# Altium project PicoBOB_DLX.PrjPCB
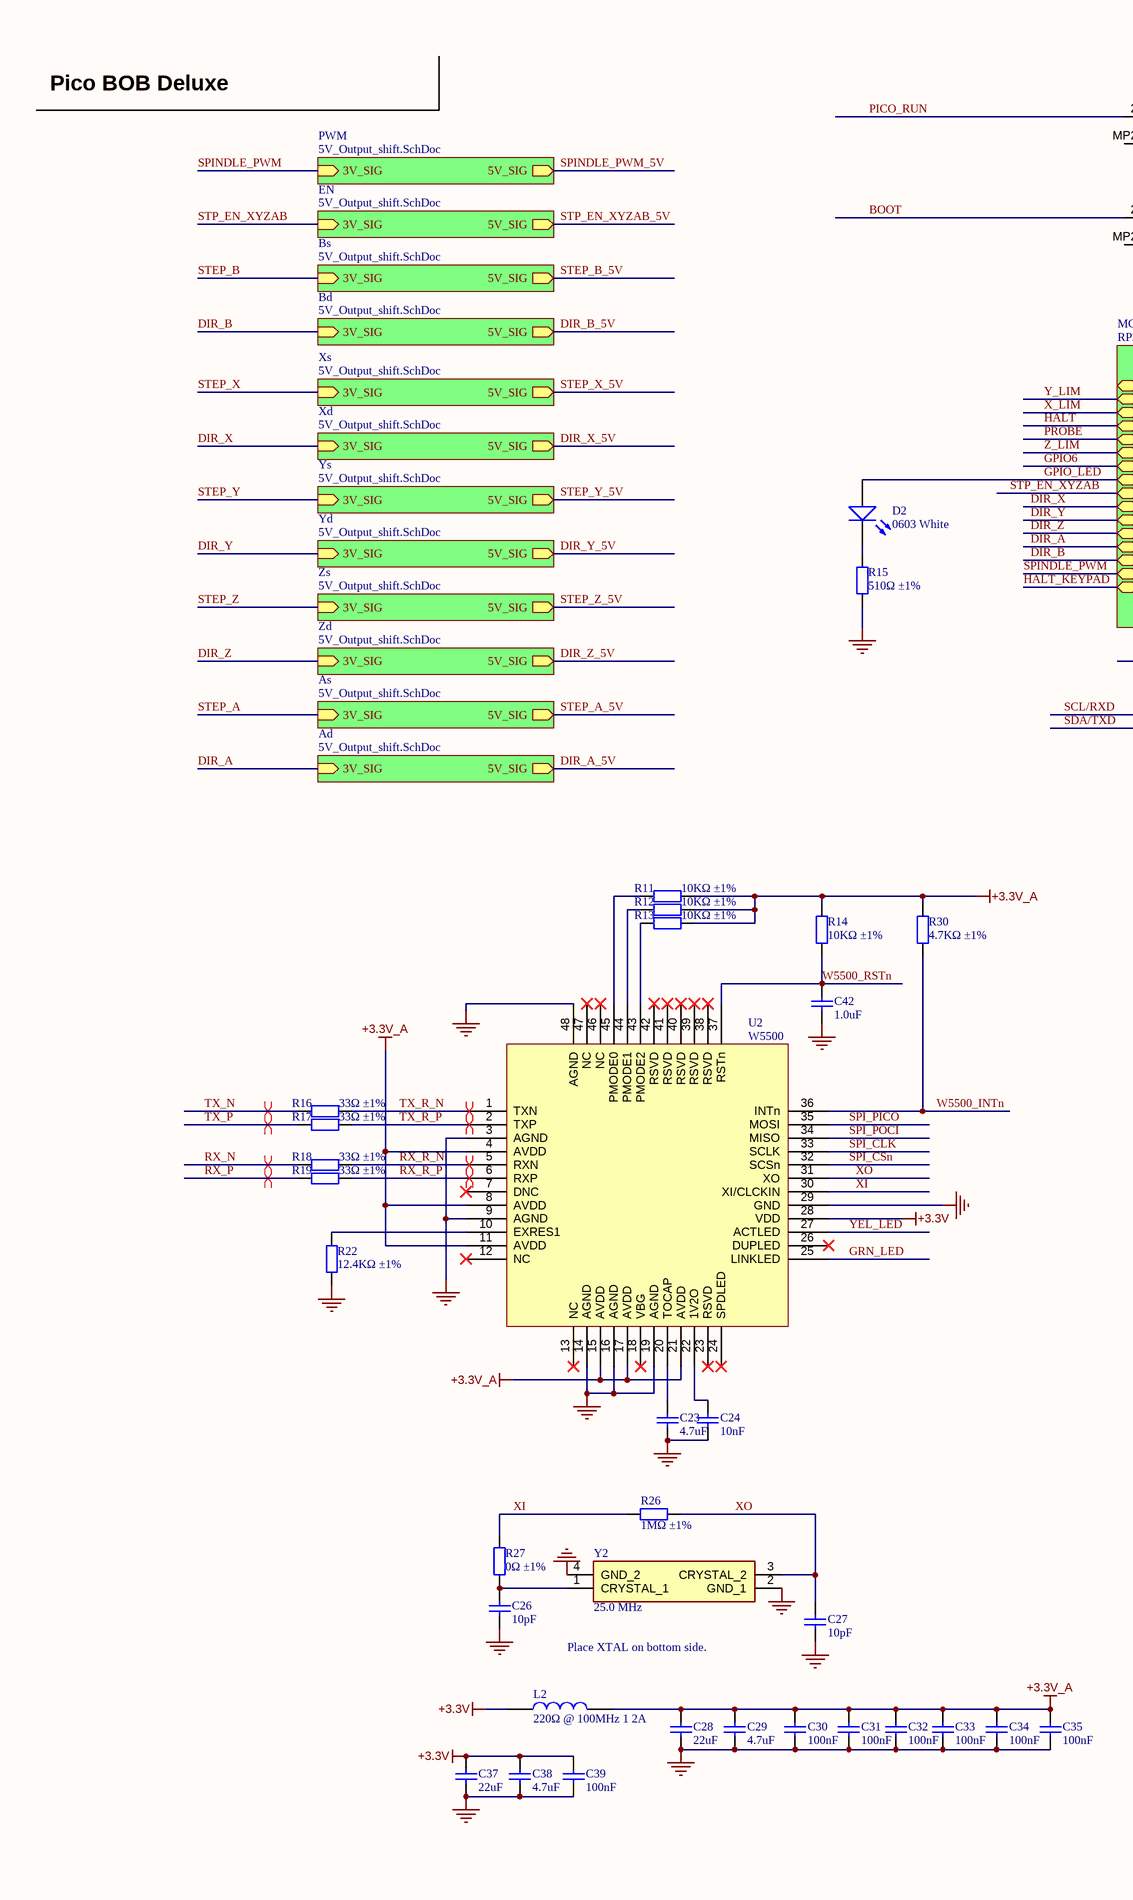
[diagram p0: PicoBOB_DLX.SchDoc, left]
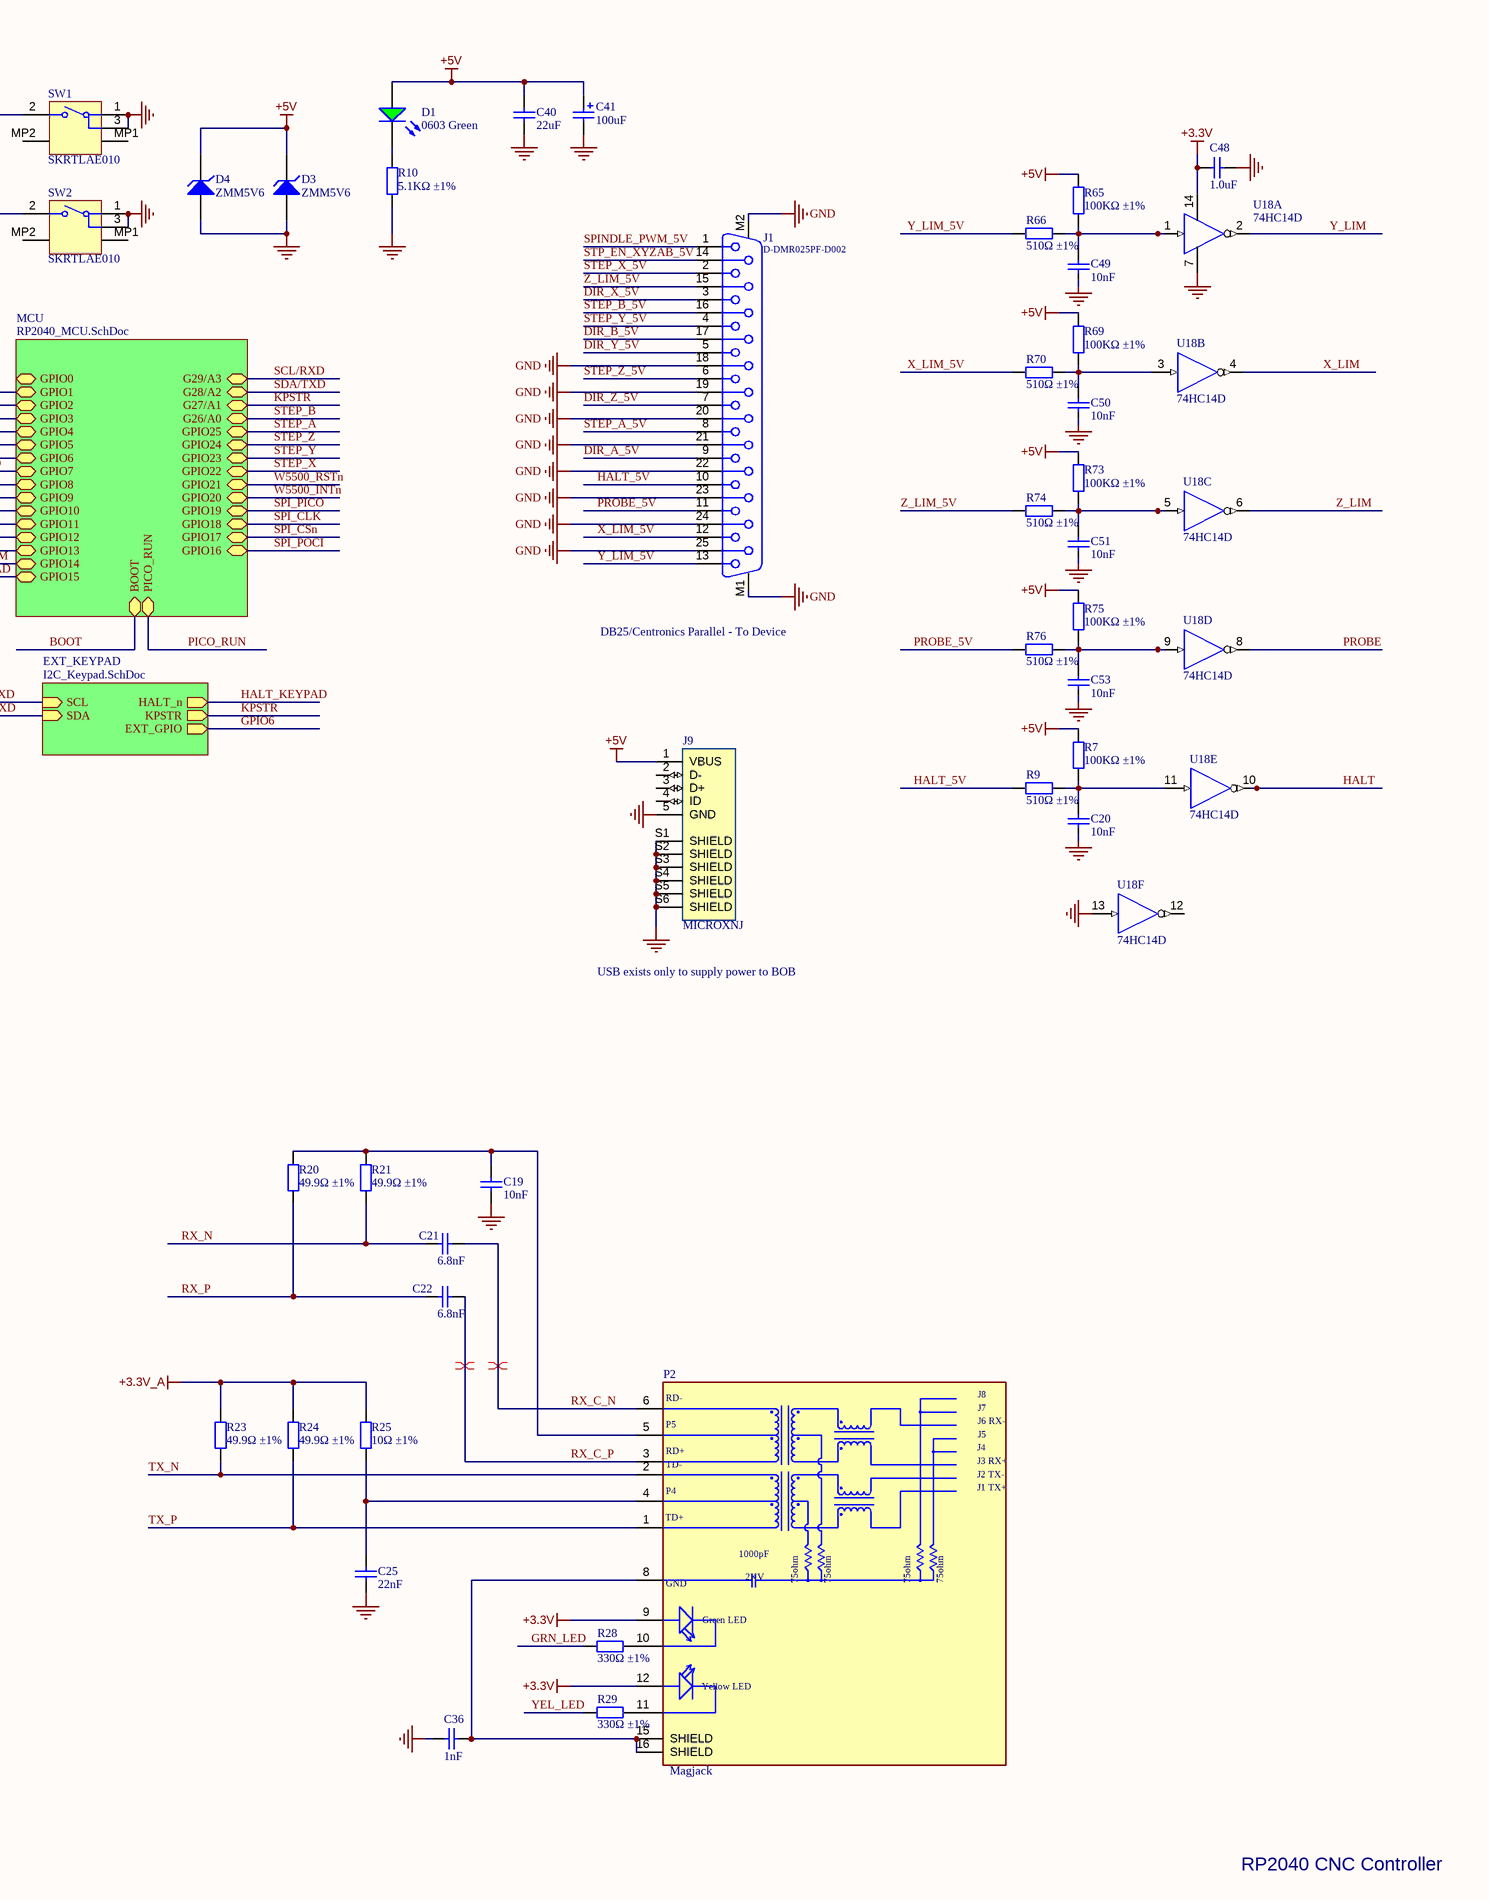
[diagram p1: PicoBOB_DLX.SchDoc, right]
PCBPARTNO: PicoBOB_DLX; PCBREVNO: A3; Title: PicoBOB_DLX; VarRevNo: A3
4 sheets, 143 parts. Net scope: hierarchical (ports join the sheet entries above them; power ports are global).
Board file: PicoBOB_DLX.pcbdoc
Sheets:
  PicoBOB_DLX.SchDoc
    PWM = 5V_Output_shift.SchDoc
    EN = 5V_Output_shift.SchDoc
    Xs = 5V_Output_shift.SchDoc
    Xd = 5V_Output_shift.SchDoc
    Ys = 5V_Output_shift.SchDoc
    Yd = 5V_Output_shift.SchDoc
    Zs = 5V_Output_shift.SchDoc
    Zd = 5V_Output_shift.SchDoc
    As = 5V_Output_shift.SchDoc
    Ad = 5V_Output_shift.SchDoc
    Bs = 5V_Output_shift.SchDoc
    Bd = 5V_Output_shift.SchDoc
    MCU = RP2040_MCU.SchDoc
    EXT_KEYPAD = I2C_Keypad.SchDoc

## Sheet PicoBOB_DLX.SchDoc: RP2040 CNC
size C; Author: AM; CompanyName: Expatria Technologies; DrawnBy: A.Marles; Engineer: AM; Organization: Expatria Technolgoies; Address1: Schematic; DocumentNumber: 2; Revision: A3; SheetNumber: 2; SheetTotal: 4

### Parts
C19  10nF  [0402_C]
C20  10nF  [0402_C]
C21  6.8nF  [0402_C]
C22  6.8nF  [0402_C]
C23  4.7uF  [0402_C]
C24  10nF  [0402_C]
C25  22nF  [0402_C]
C26  10pF  [0402_C]
C27  10pF  [0402_C]
C28  22uF  [0805_C]
C29  4.7uF  [0603_C]
C30  100nF  [0402_C]
C31  100nF  [0402_C]
C32  100nF  [0402_C]
C33  100nF  [0402_C]
C34  100nF  [0402_C]
C35  100nF  [0402_C]
C36  1nF  [1206_C]
C37  22uF  [0805_C]
C38  4.7uF  [0603_C]
C39  100nF  [0402_C]
C40  22uF  [0805_C]
C41  100uF  [CASE-B_3528]
C42  1.0uF  [0402_C]
C48  1.0uF  [0402_C]
C49  10nF  [0402_C]
C50  10nF  [0402_C]
C51  10nF  [0402_C]
C53  10nF  [0402_C]
D1  0603 Green  [0603_LED_S1]
D2  0603 White  [0603_LED_S1]
D3  ZMM5V6  [LL-34]
D4  ZMM5V6  [LL-34]
J1  D-DMR025PF-D002  [618025231121]
J9  MICROXNJ  [SHOUHAN_MICROXNJ]
L2  220Ω @ 100MHz 1 2A  [0805_C]
P2  Magjack  [HANRUN_HR911105A]
R7  100KΩ ±1%  [0402_R]
R9  510Ω ±1%  [0402_R]
R10  5.1KΩ ±1%  [0402_R]
R11  10KΩ ±1%  [0402_R]
R12  10KΩ ±1%  [0402_R]
R13  10KΩ ±1%  [0402_R]
R14  10KΩ ±1%  [0402_R]
R15  510Ω ±1%  [0402_R]
R16  33Ω ±1%  [0402_R]
R17  33Ω ±1%  [0402_R]
R18  33Ω ±1%  [0402_R]
R19  33Ω ±1%  [0402_R]
R20  49.9Ω ±1%  [0402_R]
R21  49.9Ω ±1%  [0402_R]
R22  12.4KΩ ±1%  [0603_R]
R23  49.9Ω ±1%  [0402_R]
R24  49.9Ω ±1%  [0402_R]
R25  10Ω ±1%  [0402_R]
R26  1MΩ ±1%  [0402_R]
R27  0Ω ±1%  [0402_R]
R28  330Ω ±1%  [0402_R]
R29  330Ω ±1%  [0402_R]
R30  4.7KΩ ±1%  [0402_R]
R65  100KΩ ±1%  [0402_R]
R66  510Ω ±1%  [0402_R]
R69  100KΩ ±1%  [0402_R]
R70  510Ω ±1%  [0402_R]
R73  100KΩ ±1%  [0402_R]
R74  510Ω ±1%  [0402_R]
R75  100KΩ ±1%  [0402_R]
R76  510Ω ±1%  [0402_R]
SW1  SKRTLAE010  [ALPS-SKRTLAE010_V]
SW2  SKRTLAE010  [ALPS-SKRTLAE010_V]
U2  W5500  [LQFP-48_7x7x05P]
U18  74HC14D  [SOIC-14_150mil]  (parts A,B,C,D,E,F of 6)
Y2  25.0 MHz  [YSX321SL]

### Sub-sheets
Ad = 5V_Output_shift.SchDoc: 3V_SIG (in), 5V_SIG (out)
As = 5V_Output_shift.SchDoc: 3V_SIG (in), 5V_SIG (out)
Bd = 5V_Output_shift.SchDoc: 3V_SIG (in), 5V_SIG (out)
Bs = 5V_Output_shift.SchDoc: 3V_SIG (in), 5V_SIG (out)
EN = 5V_Output_shift.SchDoc: 3V_SIG (in), 5V_SIG (out)
EXT_KEYPAD = I2C_Keypad.SchDoc: HALT_n (out), SCL (in), KPSTR (out), SDA (in), EXT_GPIO (out)
MCU = RP2040_MCU.SchDoc: G28/A2 (bidir), GPIO20 (bidir), GPIO14 (bidir), GPIO25 (bidir), GPIO15 (bidir), GPIO8 (bidir), GPIO1 (bidir), G27/A1 (bidir), GPIO0 (bidir), GPIO13 (bidir), G26/A0 (bidir), GPIO21 (bidir), PICO_RUN (bidir), G29/A3 (bidir), GPIO7 (bidir), GPIO6 (bidir), GPIO12 (bidir), GPIO2 (bidir), GPIO4 (bidir), GPIO17 (bidir), GPIO10 (bidir), GPIO11 (bidir), GPIO23 (bidir), GPIO22 (bidir), GPIO18 (bidir), GPIO5 (bidir), GPIO9 (bidir), GPIO3 (bidir), GPIO24 (bidir), GPIO19 (bidir), GPIO16 (bidir), BOOT (bidir)
PWM = 5V_Output_shift.SchDoc: 3V_SIG (in), 5V_SIG (out)
Xd = 5V_Output_shift.SchDoc: 3V_SIG (in), 5V_SIG (out)
Xs = 5V_Output_shift.SchDoc: 3V_SIG (in), 5V_SIG (out)
Yd = 5V_Output_shift.SchDoc: 3V_SIG (in), 5V_SIG (out)
Ys = 5V_Output_shift.SchDoc: 3V_SIG (in), 5V_SIG (out)
Zd = 5V_Output_shift.SchDoc: 3V_SIG (in), 5V_SIG (out)
Zs = 5V_Output_shift.SchDoc: 3V_SIG (in), 5V_SIG (out)

### Nets
+3.3V: C37.2 C38.2 C39.2 C48.1 L2.1 P2.9(GA) P2.12(YA) U2.28(VDD) U18.14(VDD)
+3.3V_A: C28.2 C29.2 C30.2 C31.2 C32.2 C33.2 C34.2 C35.2 L2.2 R11.1 R12.1 R13.1 R14.2 R23.1 R24.1 R25.1 R30.2 U2.4(AVDD) U2.8(AVDD) U2.11(AVDD) U2.15(AVDD) U2.17(AVDD) U2.21(AVDD)
+5V: C40.2 C41.1 D1.A D3.2(K) D4.2(K) J9.1(VBUS) R7.2 R65.2 R69.2 R73.2 R75.2
GND: C19.1 C20.1 C23.1 C24.1 C25.1 C26.1 C27.1 C28.1 C29.1 C30.1 C31.1 C32.1 C33.1 C34.1 C35.1 C36.1 C37.1 C38.1 C39.1 C40.1 C41.2 C42.1 C48.2 C49.1 C50.1 C51.1 C53.1 D3.1(A) D4.1(A) J1.18 J1.19 J1.20 J1.21 J1.22 J1.23 J1.24 J1.25 J1.M1 J1.M2 J9.5(GND) J9.S1(SHIELD) J9.S2(SHIELD) J9.S3(SHIELD) J9.S4(SHIELD) J9.S5(SHIELD) J9.S6(SHIELD) R10.2 R15.1 R22.1 SW1.1 SW1.3 SW2.1 SW2.3 U2.3(AGND) U2.9(AGND) U2.14(AGND) U2.16(AGND) U2.19(AGND) U2.29(GND) U2.48(AGND) U18.7(GND) U18.13(A) Y2.2(GND_1) Y2.4(GND_2)
BOOT: SW2.2 ; sheet MCU/BOOT
DIR_A: sheet Ad/3V_SIG, sheet MCU/GPIO12
DIR_A_5V: J1.9 ; sheet Ad/5V_SIG
DIR_B: sheet Bd/3V_SIG, sheet MCU/GPIO13
DIR_B_5V: J1.17 ; sheet Bd/5V_SIG
DIR_X: sheet Xd/3V_SIG, sheet MCU/GPIO9
DIR_X_5V: J1.3 ; sheet Xd/5V_SIG
DIR_Y: sheet Yd/3V_SIG, sheet MCU/GPIO10
DIR_Y_5V: J1.5 ; sheet Yd/5V_SIG
DIR_Z: sheet Zd/3V_SIG, sheet MCU/GPIO11
DIR_Z_5V: J1.7 ; sheet Zd/5V_SIG
GPIO6: sheet MCU/GPIO6, sheet EXT_KEYPAD/EXT_GPIO
GPIO_LED: D2.A ; sheet MCU/GPIO7
GRN_LED: R28.1 U2.25(LINKLED)
HALT: U18.10(Y) ; sheet MCU/GPIO3
HALT_5V: J1.10 R9.1
HALT_KEYPAD: sheet MCU/GPIO15, sheet EXT_KEYPAD/HALT_n
KPSTR: sheet MCU/G27/A1, sheet EXT_KEYPAD/KPSTR
PICO_RUN: SW1.2 ; sheet MCU/PICO_RUN
PROBE: U18.8(Y) ; sheet MCU/GPIO4
PROBE_5V: J1.11 R76.1
RX_C_N: C21.1 P2.6(RD-)
RX_C_P: C22.1 P2.3(RD+)
RX_N: C21.2 R18.1 R21.2
RX_P: C22.2 R19.1 R20.2
RX_R_N: R18.2 U2.5(RXN)
RX_R_P: R19.2 U2.6(RXP)
SCL/RXD: sheet MCU/G29/A3, sheet EXT_KEYPAD/SCL
SDA/TXD: sheet MCU/G28/A2, sheet EXT_KEYPAD/SDA
SPI_CLK: U2.33(SCLK) ; sheet MCU/GPIO18
SPI_CSn: U2.32(SCSn) ; sheet MCU/GPIO17
SPI_PICO: U2.35(MOSI) ; sheet MCU/GPIO19
SPI_POCI: U2.34(MISO) ; sheet MCU/GPIO16
SPINDLE_PWM: sheet PWM/3V_SIG, sheet MCU/GPIO14
SPINDLE_PWM_5V: J1.1 ; sheet PWM/5V_SIG
STEP_A: sheet As/3V_SIG, sheet MCU/GPIO25
STEP_A_5V: J1.8 ; sheet As/5V_SIG
STEP_B: sheet Bs/3V_SIG, sheet MCU/G26/A0
STEP_B_5V: J1.16 ; sheet Bs/5V_SIG
STEP_X: sheet Xs/3V_SIG, sheet MCU/GPIO22
STEP_X_5V: J1.2 ; sheet Xs/5V_SIG
STEP_Y: sheet Ys/3V_SIG, sheet MCU/GPIO23
STEP_Y_5V: J1.4 ; sheet Ys/5V_SIG
STEP_Z: sheet Zs/3V_SIG, sheet MCU/GPIO24
STEP_Z_5V: J1.6 ; sheet Zs/5V_SIG
STP_EN_XYZAB: sheet EN/3V_SIG, sheet MCU/GPIO8
STP_EN_XYZAB_5V: J1.14 ; sheet EN/5V_SIG
TX_N: P2.2(TD-) R16.1 R23.2
TX_P: P2.1(TD+) R17.1 R24.2
TX_R_N: R16.2 U2.1(TXN)
TX_R_P: R17.2 U2.2(TXP)
W5500_INTn: R30.1 U2.36(INTn) ; sheet MCU/GPIO20
W5500_RSTn: C42.2 R14.1 U2.37(RSTn) ; sheet MCU/GPIO21
X_LIM: U18.4(Y) ; sheet MCU/GPIO2
X_LIM_5V: J1.12 R70.1
XI: R26.1 R27.1 U2.30(XI/CLCKIN)
XO: C27.2 R26.2 U2.31(XO) Y2.3(CRYSTAL_2)
Y_LIM: U18.2(Y) ; sheet MCU/GPIO1
Y_LIM_5V: J1.13 R66.1
YEL_LED: R29.1 U2.27(ACTLED)
Z_LIM: U18.6(Y) ; sheet MCU/GPIO5
Z_LIM_5V: J1.15 R74.1
NetC19_2: C19.2 P2.5(P5) R20.1 R21.1
NetC20_2: C20.2 R7.1 R9.2 U18.11(A)
NetC23_2: C23.2 U2.20(TOCAP)
NetC24_2: C24.2 U2.22(1V2O)
NetC25_2: C25.2 P2.4(P4) R25.2
NetC26_2: C26.2 R27.2 Y2.1(CRYSTAL_1)
NetC36_2: C36.2 P2.8(GND) P2.15(SHIELD) P2.16(SHIELD)
NetC49_2: C49.2 R65.1 R66.2 U18.1(A)
NetC50_2: C50.2 R69.1 R70.2 U18.3(A)
NetC51_2: C51.2 R73.1 R74.2 U18.5(A)
NetC53_2: C53.2 R75.1 R76.2 U18.9(A)
NetD1_K: D1.K R10.1
NetD2_K: D2.K R15.2
NetP2_10: P2.10(GC) R28.2
NetP2_11: P2.11(YC) R29.2
NetR11_2: R11.2 U2.45(PMODE0)
NetR12_2: R12.2 U2.44(PMODE1)
NetR13_2: R13.2 U2.43(PMODE2)
NetR22_2: R22.2 U2.10(EXRES1)

Not connected (* = marked no-connect by the designer): J9 2(D-) 3(D+) 4(ID); SW1 MP1 MP2; SW2 MP1 MP2; U2 7(DNC)* 12(NC)* 13(NC)* 18(VBG)* 23(RSVD)* 24(SPDLED)* 26(DUPLED)* 38(RSVD)* 39(RSVD)* 40(RSVD)* 41(RSVD)* 42(RSVD)* 46(NC)* 47(NC)*; U18 12(Y)

### Layout directives
differential pair: RX_C_N, RX_C_P, RX_N, RX_P, RX_R_N, RX_R_P, TX_N, TX_P, TX_R_N, TX_R_P

### Notes on the sheet
- Pico BOB Deluxe
- DB25/Centronics Parallel - To Device
- USB exists only to supply power to BOB
- Place XTAL on bottom side.
- RP2040 CNC Controller
- Expatria Technologies
- SHEET
- PROJECT
- REV
- 1136 Glade Court
- Port Coquitlam, BC V3B 1R5
- EMAIL: INFO@EXPATRIA.CA
- SIZE
- ENGR
- C
- MODIFIED
- DOCUMENT
- /
- Copyright Expatria Technologies 2023. This document describes Open Hardware and is licensed under the CERN-OHL-S v2. No warranty is implied or expressed.
- (in symbol HR911105A) J8; J7; J6 RX-; J5; J4; J3 RX+; J2 TX-; J1 TX+; 1000pF; 2KV; 75ohm; Green LED; Yellow LED

### Library data of the parts
C19 C20 C24 C49-C51 C53 = 0402 10nF (103) 10% 50V: Chip capacitors; Manufacturer: Samsung Electro-Mechanics; PartNumber: CL05B103KB5NNNC; Tolerance: 10%; Voltage: 50V; ComponentLink1Description: Supplier link; ComponentLink1URL: http://www.szlcsc.com/product/details_15869.html; Package: 0402; Supplier: LC; SuppliersPartNumber: C15195; Capacitance: 10nF
C21 C22 = 0402 6.8nF (682) 10% 50V: Chip capacitors; Manufacturer: Guangdong Fenghua Advanced Tech; PartNumber: 0402B682K500NT; Tolerance: 10%; Voltage: 50V; ComponentLink1Description: Supplier link; ComponentLink1URL: http://www.szlcsc.com/product/details_1894.html; Package: 0402; Supplier: LC; SuppliersPartNumber: C1542; Capacitance: 6.8nF
C23 = 0402 4.7uF (475) 20% 10V: Chip capacitor; Manufacturer: Samsung Electro-Mechanics; PartNumber: CL05A475MP5NRNC; Tolerance: 20%; Voltage: 10V; ComponentLink1Description: Supplier link; ComponentLink1URL: http://www.szlcsc.com/product/details_24469.html; Package: 0402; Supplier: LC; SuppliersPartNumber: C23733; Capacitance: 4.7uF
C25 = 0402 22nF (223) 10% 50V: Chip capacitors; Manufacturer: Guangdong Fenghua Advanced Tech; PartNumber: 0402B223K500NT; Tolerance: 10%; Voltage: 50V; ComponentLink1Description: Supplier link; ComponentLink1URL: http://www.szlcsc.com/product/details_1884.html; Package: 0402; Supplier: LC; SuppliersPartNumber: C1532; Capacitance: 22nF
C26 C27 = 0402 10pF (100) 5% 50V: Chip capacitors; Manufacturer: Samsung Electro-Mechanics; PartNumber: CL05C100JB5NNNC; Tolerance: 5%; Voltage: 50V; ComponentLink1Description: Supplier link; ComponentLink1URL: http://www.szlcsc.com/product/details_33914.html; Package: 0402; Supplier: LC; SuppliersPartNumber: C32949; Capacitance: 10pF
C28 C37 C40 = 0805 22uF (226) 20% 25V: Chip capacitors; Manufacturer: Samsung Electro-Mechanics; PartNumber: CL21A226MAQNNNE; Tolerance: 20%; Voltage: 25V; ComponentLink1Description: Supplier link; ComponentLink1URL: http://www.szlcsc.com/product/details_46786.html; Package: 0805; Supplier: LC; SuppliersPartNumber: C2922481; Capacitance: 22uF
C29 C38 = 0603 4.7uF (475) 10% 16V: Chip capacitors; Manufacturer: Samsung Electro-Mechanics; PartNumber: CL10A475KO8NNNC; Tolerance: 10%; Voltage: 16V; ComponentLink1Description: Supplier link; ComponentLink1URL: http://www.szlcsc.com/product/details_20375.html; Package: 0603; Supplier: LC; SuppliersPartNumber: C19666; Capacitance: 4.7uF
C30-C35 C39 = 0402 100nF (104) 10% 16V: Chip capacitors; Manufacturer: Samsung Electro-Mechanics; PartNumber: CL05B104KO5NNNC; Tolerance: 10%; Voltage: 16V; ComponentLink1Description: Supplier link; ComponentLink1URL: http://www.szlcsc.com/product/details_1877.html; Package: 0402; Supplier: LC; SuppliersPartNumber: C1525; Capacitance: 100nF
C36 = 1206 1nF (102) 10% 500V: Chip capacitors; Manufacturer: Samsung Electro-Mechanics; PartNumber: CL31B102KGFNNNE; Tolerance: 10%; Voltage: 500V; ComponentLink1Description: Supplier link; ComponentLink1URL: http://www.szlcsc.com/product/details_36187.html; Package: 1206; Supplier: LC; SuppliersPartNumber: C35216; Capacitance: 1nF
C41 = 3528 100uF (107) 10% 6.3V: Tantalum capacitor; Manufacturer: AVX; PartNumber: TAJB107K006RNJ; Tolerance: 10%; Voltage: 6.3V; ComponentLink1Description: Supplier link; ComponentLink1URL: http://www.szlcsc.com/product/details_16815.html; Package: 3528; Supplier: LC; SuppliersPartNumber: C16133; Capacitance: 100uF
C42 C48 = 0402 1.0uF (105) 10% 25V: Chip capacitor; Manufacturer: Samsung Electro-Mechanics; PartNumber: CL05A105KA5NQNC; Capacitance: 1uF; Tolerance: 10%; Voltage: 25V; ComponentLink1Description: Supplier link; ComponentLink1URL: http://www.szlcsc.com/product/details_53938.html; Package: 0402; Supplier: LC; SuppliersPartNumber: C52923
D1 = 0603 LED Green: LED; ComponentLink1Description: 供应商链接; ComponentLink1URL: http://www.szlcsc.com/product/details_73152.html; Package: 0603; Supplier: LC; SuppliersPartNumber: C72043; Color: Green
D2 = 0603 LED White: LED; Package: 0603; Supplier: LC; SuppliersPartNumber: C2290; Color: White; ComponentLink1Description: 供应商链接; ComponentLink1URL: http://www.szlcsc.com/product/details_2663.html
D3 D4 = LL-34 ZMM5V6: 500mW - 0.1uA @ 1V 5.6V LL-34 Zener Diodes ROHS; ComponentLink1Description: 供应商链接; ComponentLink1URL: http://www.szlcsc.com/product/details_8541.html; Package: LL-34; Supplier: LC; SuppliersPartNumber: C8062
J1 = CMP-1502-00202-1: Through Hole,P=2.77mm D-Sub Connectors ROHS; SuppliersPartNumber: C190083; PartNumber: D-DMR025PF-D002
J9 = MICROXNJ: Micro USB; MF: Shouhan; Package: Package; SuppliersPartNumber: C404969; Check_prices: https://www.snapeda.com/parts/MICROXNJ/Shouhan/view-part/5703693/?ref=eda; Price: None; SnapEDA_Link: https://www.snapeda.com/parts/MICROXNJ/Shouhan/view-part/5703693/?ref=snap; Availability: Unavailable; MP: MICROXNJ; Value: *
L2 = 0402 220R@100Mhz 0.1A: 220Ω @ 100MHz 1 2A 150mΩ 0805 Ferrite Beads ROHS; Notepad: *; Package: 0805; Supplier: LC; SuppliersPartNumber: C139188
P2 = HR911105A: HR911105A Ethernet Interface Arduino Platform Evaluation Expansion Board; MF: DFRobot; SuppliersPartNumber: C163507; Package: None; Availability: Unavailable; MP: HR911105A; Value: *; Price: None
R7 R65 R69 R73 R75 = 0402 100K (1003) 1%: Chip resistor; Manufacturer: Uniroyal Elec; PartNumber: 0402WGF1003TCE; Power: 1/16W; ComponentLink1Description: Supplier link; ComponentLink1URL: http://www.szlcsc.com/product/details_26484.html; Package: 0402; Supplier: LC; SuppliersPartNumber: C25741; Resistance: 100KΩ; Tolerance: 1%
R9 R15 R66 R70 R74 R76 = 0402 510R (5100) 1%: Chip resistor; Manufacturer: Uniroyal Elec; PartNumber: 0402WGF5100TCE; Power: 1/16W; ComponentLink1Description: Supplier link; ComponentLink1URL: http://www.szlcsc.com/product/details_25866.html; Package: 0402; Supplier: LC; SuppliersPartNumber: C25123; Resistance: 510Ω; Tolerance: 1%
R10 = 0402 5.1K (5101) 1%: Chip resistor; Manufacturer: Uniroyal Elec; PartNumber: 0402WGF5101TCE; Power: 1/16W; Resistance: 51.1KΩ; ComponentLink1Description: Supplier link; ComponentLink1URL: http://www.szlcsc.com/product/details_26648.html; Package: 0402; Supplier: LC; SuppliersPartNumber: C25905; Tolerance: 1%
R11-R14 = 0402 10K (1002) 1%: Chip resistor; Manufacturer: Uniroyal Elec; PartNumber: 0402WGF1002TCE; Power: 1/16W; ComponentLink1Description: Supplier link; ComponentLink1URL: http://www.szlcsc.com/product/details_26487.html; Package: 0402; Supplier: LC; SuppliersPartNumber: C25744; Resistance: 10KΩ; Tolerance: 1%
R16-R19 = 0402 33R (33R0) 1%: Chip resistor; Manufacturer: Uniroyal Elec; PartNumber: 0402WGF330JTCE; Power: 1/16W; ComponentLink1Description: Supplier link; ComponentLink1URL: http://www.szlcsc.com/product/details_25848.html; Package: 0402; Supplier: LC; SuppliersPartNumber: C25105; Resistance: 33Ω; Tolerance: 1%
R20 R21 R23 R24 = 0402 49.9R (49R9) 1%: Chip resistor; Manufacturer: Uniroyal Elec; PartNumber: 0402WGF499JTCE; Power: 1/16W; ComponentLink1Description: Supplier link; ComponentLink1URL: http://www.szlcsc.com/product/details_25863.html; Package: 0402; Supplier: LC; SuppliersPartNumber: C25120; Resistance: 49.9Ω; Tolerance: 1%
R22 = 0603 10K (1002) 1%: Chip resistor; Manufacturer: Uniroyal Elec; PartNumber: 0603WAF1242T5E; Power: 1/10W; Resistance: 12.4K; ComponentLink1Description: Supplier link; ComponentLink1URL: http://www.szlcsc.com/product/details_26547.html; Package: 0603; Supplier: LC; SuppliersPartNumber: C22865; Tolerance: 1%
R25 = 0402 10R (10R0) 1%: Chip resistor; Manufacturer: Uniroyal Elec; PartNumber: 0402WGF100JTCE; Power: 1/16W; ComponentLink1Description: Supplier link; ComponentLink1URL: http://www.szlcsc.com/product/details_25820.html; Package: 0402; Supplier: LC; SuppliersPartNumber: C25077; Resistance: 10Ω; Tolerance: 1%
R26 = 0402 1M (1004) 1%: Chip resistor; Manufacturer: Uniroyal Elec; PartNumber: 0402WGF1004TCE; Power: 1/16W; ComponentLink1Description: Supplier link; ComponentLink1URL: http://www.szlcsc.com/product/details_26826.html; Package: 0402; Supplier: LC; SuppliersPartNumber: C26083; Resistance: 1MΩ; Tolerance: 1%
R27 = 0402 0R (0R0) 1%: Chip resistor; Manufacturer: Uniroyal Elec; PartNumber: 0402WGF0000TCE; Power: 1/16W; ComponentLink1Description: Supplier link; ComponentLink1URL: http://www.szlcsc.com/product/details_17853.html; Package: 0402; Supplier: LC; SuppliersPartNumber: C17168; Resistance: 0Ω; Tolerance: 1%
R28 R29 = 0402 330R (3300) 1%: Chip resistor; Manufacturer: Uniroyal Elec; PartNumber: 0402WGF3300TCE; Power: 1/16W; ComponentLink1Description: Supplier link; ComponentLink1URL: http://www.szlcsc.com/product/details_25847.html; Package: 0402; Supplier: LC; SuppliersPartNumber: C25104; Resistance: 330Ω; Tolerance: 1%
R30 = 0402 4.7K (4701) 1%: Chip resistor; Manufacturer: Uniroyal Elec; PartNumber: 0402WGF4701TCE; Power: 1/16W; ComponentLink1Description: Supplier link; ComponentLink1URL: http://www.szlcsc.com/product/details_26643.html; Package: 0402; Supplier: LC; SuppliersPartNumber: C25900; Resistance: 4.7KΩ; Tolerance: 1%
SW1 SW2 = CMP-2000-07073-2: Side Push Type, 250 V, -40 to 90 degC, 3-Pin SMD, RoHS, Tape and Reel; Manufacturer: ALPS; Operating Force: 1.6N; Folder: Unified Components\Components\New Releases\New\; Maximum Current Rating: 0.05@12VDCA; RevisionId: 1; Pole Throw Configuration: SPST; Switch Configuration: N.O.; AccessRights: 2147483647; Maximum DC Voltage Rating: 12V; ContentType: Unified Component; Rad Hard: No; Mounting: SurfaceMount; Datasheet URL: http://www.alps.com/prod/info/E/PDF/Tact/SurfaceMount/SKRT/SKRT.PDF; Manufacturer URL: http://www.alps.com/e/; ReleaseDate: 22/09/2017 06:13:25 AM; ItemHRID: CMP-2000-07073; ContentTypeGUID: CB3C11C4-E317-11DF-B822-12313F0024A2; LifeCycle: Released; ItemGUID: EAC55BEC-37DC-4BDB-8BA7-D75E6D5C3D75; Packaging: Tape&Reel; Package Reference: SKRTLAE010; FolderGUID: B7F4506A-9127-42E7-A087-46FE7B18D116; Datasheet Version: 06/2015; Mounting Technology: SurfaceMount; LifeCycleStateGUID: 61E382EE-6656-4F12-9E24-BE9327104A25; Package Description: 3-Pin Surface Mount Device, Body 4.5 x 3.55 mm, Pitch 1.225 mm; SuppliersPartNumber: C110293; Manufacturer 1: ALPS
U2 = W5500_[C32843]: Ethernet Controllers 2.97V ~ 3.63V 10/100 Base-T/TX PHY SPI LQFP-48_7x7x05P Ethernet ICs ROHS; ComponentLink1Description: 供应商链接; ComponentLink1URL: http://www.szlcsc.com/product/details_33808.html; Package: LQFP-48_7x7x05P; Supplier: LC; SuppliersPartNumber: C32843
U18 = 74HC14D_[C5605]: 74系列逻辑芯片; ComponentLink1Description: 供应商链接; ComponentLink1URL: http://www.szlcsc.com/product/details_6056.html; Package: SOIC-14_150mil; Supplier: LC; SuppliersPartNumber: C5605
Y2 = YSX321SL: Crystal or Oscillator; Manufacturer_Name: Yangxing Tech; Manufacturer_Part_Number: X322525MSB4SI; Height: 0.8mm; SuppliersPartNumber: C13740

## Sheet 5V_Output_shift.SchDoc: RP2040 CNC
size B; Author: AM; CompanyName: Expatria Technologies; DrawnBy: A.Marles; Engineer: AM; Organization: Expatria Technolgoies; DocumentNumber: 4; Revision: A3; SheetNumber: 4; SheetTotal: 4
Used 12 times, as channels PWM, EN, Xs, Xd, Ys, Yd, Zs, Zd, As, Ad, Bs, Bd. Parts and nets are listed once, with the designators drawn on the sheet.
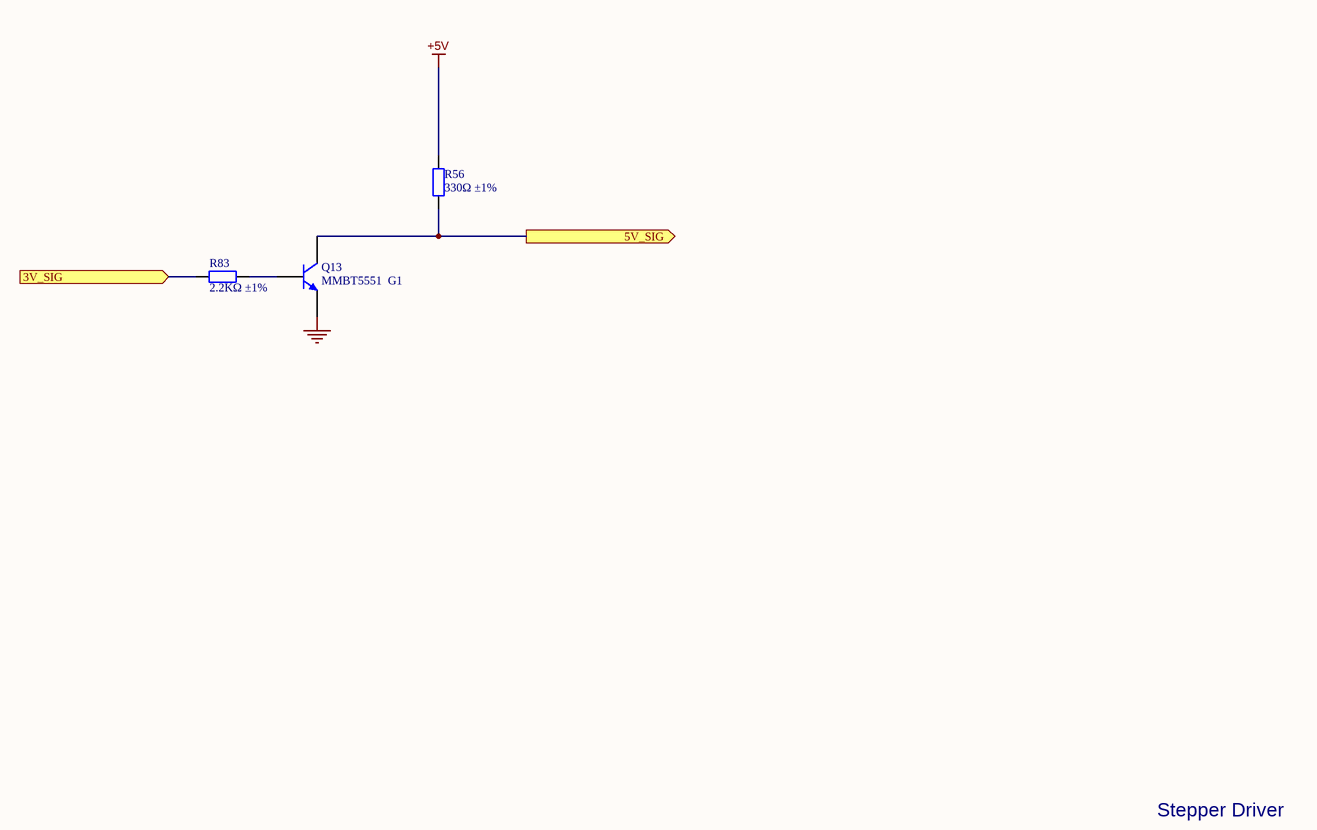
[diagram p2: 5V_Output_shift.SchDoc]

### Parts
Q13  MMBT5551  G1  [SOT-23(SOT-23-3)]
R56  330Ω ±1%  [0402_R]
R83  2.2KΩ ±1%  [0402_R]

### Ports
3V_SIG (in), 5V_SIG (out)

### Nets
+5V: R56.2
GND: Q13.2(E)
3V_SIG: R83.1 ; port 3V_SIG
5V_SIG: Q13.3(C) R56.1 ; port 5V_SIG
NetQ13_1: Q13.1(B) R83.2

### Channels
PWM: designators end in _PWM; ports 3V_SIG=SPINDLE_PWM 5V_SIG=SPINDLE_PWM_5V
EN: designators end in _EN; ports 3V_SIG=STP_EN_XYZAB 5V_SIG=STP_EN_XYZAB_5V
Xs: designators end in _Xs; ports 3V_SIG=STEP_X 5V_SIG=STEP_X_5V
Xd: designators end in _Xd; ports 3V_SIG=DIR_X 5V_SIG=DIR_X_5V
Ys: designators end in _Ys; ports 3V_SIG=STEP_Y 5V_SIG=STEP_Y_5V
Yd: designators end in _Yd; ports 3V_SIG=DIR_Y 5V_SIG=DIR_Y_5V
Zs: designators end in _Zs; ports 3V_SIG=STEP_Z 5V_SIG=STEP_Z_5V
Zd: designators end in _Zd; ports 3V_SIG=DIR_Z 5V_SIG=DIR_Z_5V
As: designators end in _As; ports 3V_SIG=STEP_A 5V_SIG=STEP_A_5V
Ad: designators end in _Ad; ports 3V_SIG=DIR_A 5V_SIG=DIR_A_5V
Bs: designators end in _Bs; ports 3V_SIG=STEP_B 5V_SIG=STEP_B_5V
Bd: designators end in _Bd; ports 3V_SIG=DIR_B 5V_SIG=DIR_B_5V

### Notes on the sheet
- Stepper Driver
- SHEET
- Expatria Technologies
- 1136 Glade Court
- Port Coquitlam, BC V3B 1R5
- PROJECT
- SIZE
- ENGR
- MODIFIED
- DOCUMENT
- REV
- Copyright Expatria Technologies 2023. This document describes Open Hardware and is licensed under the CERN-OHL-S v2. No warranty is implied or expressed.
- EMAIL: INFO@EXPATRIA.CA
- B
- /

### Library data of the parts
Q13 = SOT-23 MMBT5551  G1: 三极管; ComponentLink1Description: 供应商链接; ComponentLink1URL: http://www.szlcsc.com/product/details_2502.html; Package: SOT-23; Supplier: LC; SuppliersPartNumber: C2145
R56 = 0402 330R (3300) 1%: as R28 on sheet PicoBOB_DLX; ComponentLink1Description: Supplier link; ComponentLink1URL: http://www.szlcsc.com/product/details_25847.html; Package: 0402; Supplier: LC; SuppliersPartNumber: C25104; Resistance: 330Ω; Tolerance: 1%
R83 = 0402 2.2K (2201) 1%: Chip resistor; Manufacturer: Uniroyal Elec; PartNumber: 0402WGF2201TCE; Power: 1/16W; ComponentLink1Description: Supplier link; ComponentLink1URL: http://www.szlcsc.com/product/details_26622.html; Package: 0402; Supplier: LC; SuppliersPartNumber: C25879; Resistance: 2.2KΩ; Tolerance: 1%

## Sheet RP2040_MCU.SchDoc: RP2040 CNC
size B; Author: AM; CompanyName: Expatria Technologies; DrawnBy: A.Marles; Engineer: AM; Organization: Expatria Technolgoies; Address1: Schematic; DocumentNumber: 3; Revision: A3; SheetNumber: 3; SheetTotal: 4
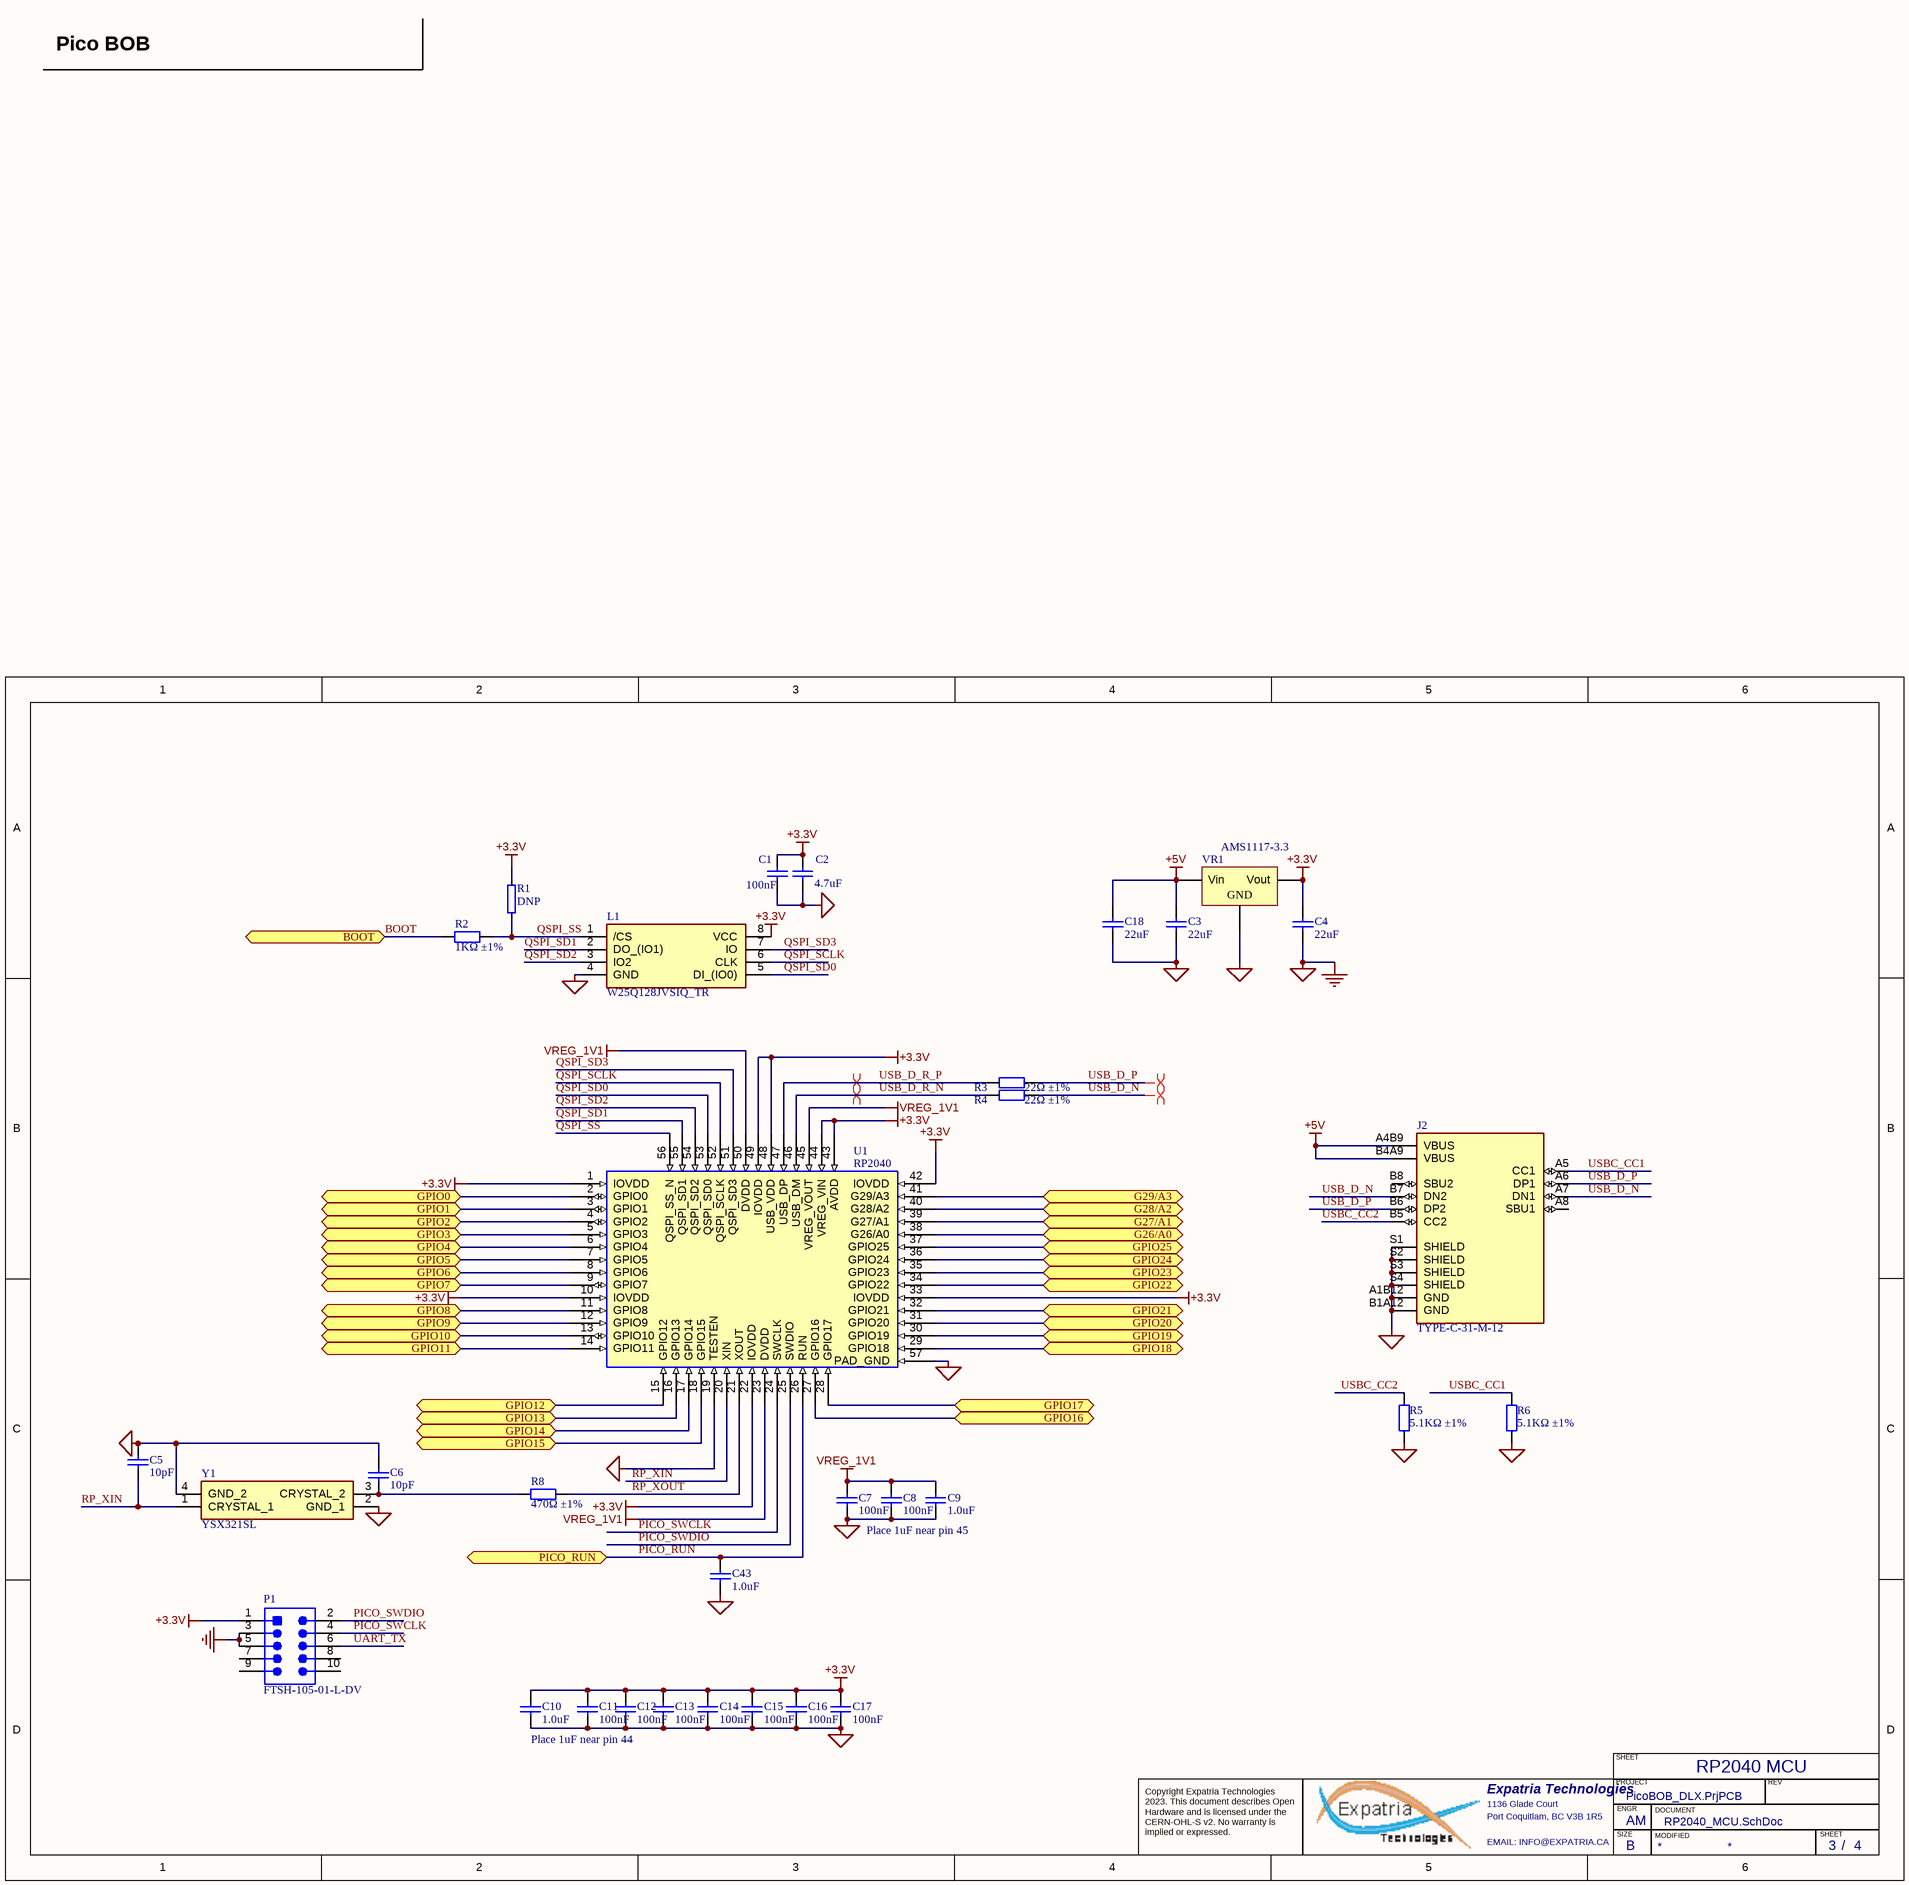
[diagram p3: RP2040_MCU.SchDoc]

### Parts
C1  100nF  [0402_C]
C2  4.7uF  [0402_C]
C3  22uF  [0805_C]
C4  22uF  [0805_C]
C5  10pF  [0402_C]
C6  10pF  [0402_C]
C7  100nF  [0402_C]
C8  100nF  [0402_C]
C9  1.0uF  [0402_C]
C10  1.0uF  [0402_C]
C11  100nF  [0402_C]
C12  100nF  [0402_C]
C13  100nF  [0402_C]
C14  100nF  [0402_C]
C15  100nF  [0402_C]
C16  100nF  [0402_C]
C17  100nF  [0402_C]
C18  22uF  [0805_C]
C43  1.0uF  [0402_C]
J2  TYPE-C-31-M-12  [HRO_TYPE-C-31-M-12]
L1  W25Q128JVSIQ_TR  [SOIC127P780X195-8N]
P1  FTSH-105-01-L-DV  [SMTC-FTSH-105-01-L-DV_V]  (no BOM)
R1  DNP  [0402]
R2  1KΩ ±1%  [0402_R]
R3  22Ω ±1%  [0402_R]
R4  22Ω ±1%  [0402_R]
R5  5.1KΩ ±1%  [0402_R]
R6  5.1KΩ ±1%  [0402_R]
R8  470Ω ±1%  [0402_R]
U1  RP2040  [RP2040]
VR1  AMS1117-3.3  [SOT-223]
Y1  YSX321SL  [YSX321SL]

### Ports
BOOT (bidir), G26/A0 (bidir), G27/A1 (bidir), G28/A2 (bidir), G29/A3 (bidir), GPIO0 (bidir), GPIO1 (bidir), GPIO2 (bidir), GPIO3 (bidir), GPIO4 (bidir), GPIO5 (bidir), GPIO6 (bidir), GPIO7 (bidir), GPIO8 (bidir), GPIO9 (bidir), GPIO10 (bidir), GPIO11 (bidir), GPIO12 (bidir), GPIO13 (bidir), GPIO14 (bidir), GPIO15 (bidir), GPIO16 (bidir), GPIO17 (bidir), GPIO18 (bidir), GPIO19 (bidir), GPIO20 (bidir), GPIO21 (bidir), GPIO22 (bidir), GPIO23 (bidir), GPIO24 (bidir), GPIO25 (bidir), PICO_RUN (bidir)

### Nets
+3.3V: C1.2 C2.2 C4.2 C10.2 C11.2 C12.2 C13.2 C14.2 C15.2 C16.2 C17.2 L1.8(VCC) P1.1 R1.2 U1.1(IOVDD) U1.10(IOVDD) U1.22(IOVDD) U1.33(IOVDD) U1.42(IOVDD) U1.43(AVDD) U1.44(VREG_VIN) U1.48(USB_VDD) U1.49(IOVDD) VR1.2(Vout)
+5V: C3.2 C18.2 J2.A4B9(VBUS) J2.B4A9(VBUS) VR1.3(Vin)
GND: C1.1 C2.1 C3.1 C4.1 C5.2 C6.2 C7.1 C8.1 C9.1 C10.1 C11.1 C12.1 C13.1 C14.1 C15.1 C16.1 C17.1 C18.1 C43.1 J2.A1B12(GND) J2.B1A12(GND) J2.S1(SHIELD) J2.S2(SHIELD) J2.S3(SHIELD) J2.S4(SHIELD) L1.4(GND) P1.3 P1.5 R5.2 R6.2 U1.19(TESTEN) U1.57(PAD_GND) VR1.1(GND) Y1.2(GND_1) Y1.4(GND_2)  [also labelled MCU_GND]
VREG_1V1: C7.2 C8.2 C9.2 U1.23(DVDD) U1.45(VREG_VOUT) U1.50(DVDD)
BOOT: R2.1 ; port BOOT
DIR_A: U1.15(GPIO12) ; port GPIO12
DIR_B: U1.16(GPIO13) ; port GPIO13
DIR_X: U1.12(GPIO9) ; port GPIO9
DIR_Y: U1.13(GPIO10) ; port GPIO10
DIR_Z: U1.14(GPIO11) ; port GPIO11
GPIO0: U1.2(GPIO0) ; port GPIO0
GPIO6: U1.8(GPIO6) ; port GPIO6
GPIO_LED: U1.9(GPIO7) ; port GPIO7
HALT: U1.5(GPIO3) ; port GPIO3
HALT_KEYPAD: U1.18(GPIO15) ; port GPIO15
KPSTR: U1.39(G27/A1) ; port G27/A1
PICO_RUN: C43.2 U1.26(RUN) ; port PICO_RUN
PICO_SWCLK: P1.4 U1.24(SWCLK)
PICO_SWDIO: P1.2 U1.25(SWDIO)
PROBE: U1.6(GPIO4) ; port GPIO4
QSPI_SCLK: L1.6(CLK) U1.52(QSPI_SCLK)
QSPI_SD0: L1.5(DI_(IO0)) U1.53(QSPI_SD0)
QSPI_SD1: L1.2(DO_(IO1)) U1.55(QSPI_SD1)
QSPI_SD2: L1.3(IO2) U1.54(QSPI_SD2)
QSPI_SD3: L1.7(IO) U1.51(QSPI_SD3)
QSPI_SS: L1.1(/CS) R1.1 R2.2 U1.56(QSPI_SS_N)
RP_XIN: C5.1 U1.20(XIN) Y1.1(CRYSTAL_1)
RP_XOUT: R8.2 U1.21(XOUT)
SCL/RXD: U1.41(G29/A3) ; port G29/A3
SDA/TXD: U1.40(G28/A2) ; port G28/A2
SPI_CLK: U1.29(GPIO18) ; port GPIO18
SPI_CSn: U1.28(GPIO17) ; port GPIO17
SPI_PICO: U1.30(GPIO19) ; port GPIO19
SPI_POCI: U1.27(GPIO16) ; port GPIO16
SPINDLE_PWM: U1.17(GPIO14) ; port GPIO14
STEP_A: U1.37(GPIO25) ; port GPIO25
STEP_B: U1.38(G26/A0) ; port G26/A0
STEP_X: U1.34(GPIO22) ; port GPIO22
STEP_Y: U1.35(GPIO23) ; port GPIO23
STEP_Z: U1.36(GPIO24) ; port GPIO24
STP_EN_XYZAB: U1.11(GPIO8) ; port GPIO8
UART_TX: P1.6
USB_D_N: J2.A7(DN1) J2.B7(DN2) R4.1
USB_D_P: J2.A6(DP1) J2.B6(DP2) R3.1
USB_D_R_N: R4.2 U1.46(USB_DM)
USB_D_R_P: R3.2 U1.47(USB_DP)
USBC_CC1: J2.A5(CC1) R6.1
USBC_CC2: J2.B5(CC2) R5.1
W5500_INTn: U1.31(GPIO20) ; port GPIO20
W5500_RSTn: U1.32(GPIO21) ; port GPIO21
X_LIM: U1.4(GPIO2) ; port GPIO2
Y_LIM: U1.3(GPIO1) ; port GPIO1
Z_LIM: U1.7(GPIO5) ; port GPIO5
NetC6_1: C6.1 R8.1 Y1.3(CRYSTAL_2)

Not connected (* = marked no-connect by the designer): J2 A8(SBU1) B8(SBU2); P1 7 8 9 10

### Layout directives
differential pair: USB_D_N, USB_D_P, USB_D_R_N, USB_D_R_P

### Notes on the sheet
- Pico BOB
- Place 1uF near pin 45
- Place 1uF near pin 44
- RP2040 MCU
- SHEET
- Expatria Technologies
- 1136 Glade Court
- Port Coquitlam, BC V3B 1R5
- PROJECT
- SIZE
- ENGR
- MODIFIED
- DOCUMENT
- REV
- Copyright Expatria Technologies 2023. This document describes Open Hardware and is licensed under the CERN-OHL-S v2. No warranty is implied or expressed.
- EMAIL: INFO@EXPATRIA.CA
- B
- /

### Library data of the parts
C1 C7 C8 C11-C17 = 0402 100nF (104) 10% 16V: as C30 on sheet PicoBOB_DLX; ComponentLink1Description: Supplier link; ComponentLink1URL: http://www.szlcsc.com/product/details_1877.html; Package: 0402; Supplier: LC; SuppliersPartNumber: C1525; Capacitance: 100nF
C2 = 0402 4.7uF (475) 20% 10V: as C23 on sheet PicoBOB_DLX; ComponentLink1Description: Supplier link; ComponentLink1URL: http://www.szlcsc.com/product/details_24469.html; Package: 0402; Supplier: LC; SuppliersPartNumber: C23733; Capacitance: 4.7uF
C3 C4 C18 = 0805 22uF (226) 20% 25V: as C28 on sheet PicoBOB_DLX; Package: 0805; Supplier: LC; SuppliersPartNumber: C2922481; Capacitance: 22uF; ComponentLink1Description: Supplier link; ComponentLink1URL: http://www.szlcsc.com/product/details_46786.html
C5 C6 = 0402 10pF (100) 5% 50V: as C26 on sheet PicoBOB_DLX; ComponentLink1Description: Supplier link; ComponentLink1URL: http://www.szlcsc.com/product/details_33914.html; Package: 0402; Supplier: LC; SuppliersPartNumber: C32949; Capacitance: 10pF
C9 C10 C43 = 0402 1.0uF (105) 10% 25V: as C42 on sheet PicoBOB_DLX; ComponentLink1Description: Supplier link; ComponentLink1URL: http://www.szlcsc.com/product/details_53938.html; Package: 0402; Supplier: LC; SuppliersPartNumber: C52923
J2 = TYPE-C-31-M-12: USB Connectors 24 Receptacle 1 8.94*7.3mm RoHS; MF: HRO Electronics Co., Ltd.; Value: *; SnapEDA_Link: https://www.snapeda.com/parts/TYPE-C-31-M-12/HRO%20Electronics%20Co.,%20Ltd./view-part/3228496/?ref=snap; Package: Package; MP: TYPE-C-31-M-12; Price: None; Availability: Unavailable; SuppliersPartNumber: C165948
L1 = W25Q128JVSIQ_TR: Inductor; Manufacturer_Name: Winbond; Manufacturer_Part_Number: W25Q128JVSIQ TR; Datasheet Link: http://www.winbond.com/resource-files/w25q128jv%20spi%20revc%2011162016.pdf; Height: 1.95mm; Mouser Part Number: 454-W25Q128JVSIQTR; Mouser Price/Stock: https://www.mouser.co.uk/ProductDetail/Winbond/W25Q128JVSIQ-TR?qs=qSfuJ%252Bfl%2Fd7vTyLA9kNdGw%3D%3D; Arrow Part Number: W25Q128JVSIQ TR; Arrow Price/Stock: https://www.arrow.com/en/products/w25q128jvsiqtr/winbond-electronics?region=nac; SuppliersPartNumber: C97521
P1 = CMP-2000-05354-1: Male Header, Pitch 1.27 mm, 2 x 5 Position, Height 5.96 mm, -55 to 125 degC, RoHS, Bulk; Manufacturer: Samtec; Connector Type: Header,Unshrouded; Pitch: 0.050"(1.27mm); Mating Products: FLE-105-01-G-DV-TR-ND-CONNSKT1.27MM10POSDUALSMDCLP-105-02-G-D-P-TR-ND-CONNRCPT10POSDUAL.05"SMDSFMC-105-L2-S-D-TR-ND-CONN.05"SURFACE10POSSMTSFMH-105-02-L-D-TR-ND-CONNRECEPT10POS.50"SMTFLE-105-01-G-DV-A-ND-CONNSKT1.27MM10POSDUALSMDCLP-105-02-G-D-BE-ND-CONNRCPT10POSDUAL.05"SMDFLE-105-01-G-DV-A-P-ND-CONNSKT1.27MM10POSDUALSMDSAM1153-05-ND-CONNRCPT10POSDUAL.05"SMDSAM1155-05-ND-CONNRCPT10POSDUAL.05"SMDSAM1154-05-ND-CONNRCPT10POSDUAL.05"SMDSFMH-105-02-L-D-LC-ND-CONNRECEPT10POS.50"SMTSAM1226-05-ND-CONNRCPT.05"10POSDUALSMD; Catalog Drawings: FTSHSeriesFTSHSeriesSMTSide; Other Names: SAM1161-05; EDA / CAD Models: DownloadfromAcceleratedDesigns; Number of Positions Loaded: All; Number of Positions: 10; Featured Product: Board-To-BoardInterconnectSystems; Online Catalog: FTSHSeries; Product Training Modules: Board-to-BoardConnectors; Category: Connectors,Interconnects; Number of Rows: 2; Contact Finish: Gold; Termination: Solder; Mounting Type: SurfaceMount; Series: FTSH; Contact Mating Length: 0.120"(3.05mm); Row Spacing: 0.050"(1.27mm); Datasheet URL: https://datasheet.ciiva.com/30493/0900766b80adfe36-30493006.pdf; Contact Finish Thickness: 10µin(0.25µm); Features: -; Standard Package: 1; Packaging: Bulk; Datasheet Version: Feb-08; Manufacturer URL: http://www.samtec.com/; Fastening Type: -; Family: RectangularConnectors-Headers,MalePins; Contact Type: MalePin; Color: Black
R1 = RES: Resistor, ±5%, 0.05W; Part Number: R0201-0R; Part number IPS: 00000003245; Value: 0R; Note: Chip Res 5%; Artikkelnr Noca: N.A.; Manufacturer: *; Manufacturer Part Number: *; ComponentLink1URL: *; ComponentLink1Description: Datasheet; ComponentLink2URL: *; ComponentLink2Description: Supplier link; HelpURL: *; Footprint Doc: 0201; LatestRevisionDate: 2017-11-09; Pin Count: 2; Publisher: Nordic Semiconductor; Published: 2014-11-13; Supplier 1: *; Supplier Part Number 1: *; Supplier 2: *; Supplier Part Number 2: *
R2 = 0402 1K (1001) 1%: Chip resistor; Manufacturer: Uniroyal Elec; PartNumber: 0402WGF1001TCE; Power: 1/16W; ComponentLink1Description: Supplier link; ComponentLink1URL: http://www.szlcsc.com/product/details_12256.html; Package: 0402; Supplier: LC; SuppliersPartNumber: C11702; Resistance: 1KΩ; Tolerance: 1%
R3 R4 = 0402 22R (22R0) 1%: Chip resistor; Manufacturer: Uniroyal Elec; PartNumber: 0402WGF220JTCE; Power: 1/16W; ComponentLink1Description: Supplier link; ComponentLink1URL: http://www.szlcsc.com/product/details_25835.html; Package: 0402; Supplier: LC; SuppliersPartNumber: C25092; Resistance: 22Ω; Tolerance: 1%
R5 R6 = 0402 5.1K (5101) 1%: as R10 on sheet PicoBOB_DLX; ComponentLink1Description: Supplier link; ComponentLink1URL: http://www.szlcsc.com/product/details_26648.html; Package: 0402; Supplier: LC; SuppliersPartNumber: C25905; Tolerance: 1%
R8 = 0402 470R (4700) 1%: Chip resistor; Manufacturer: Uniroyal Elec; PartNumber: 0402WGF4700TCE; Power: 1/16W; ComponentLink1Description: Supplier link; ComponentLink1URL: http://www.szlcsc.com/product/details_25860.html; Package: 0402; Supplier: LC; SuppliersPartNumber: C25117; Resistance: 470Ω; Tolerance: 1%
U1 = RP2040: RP2040 First MCU from RPI
VR1 = SOT-223 AMS1117-3.3: Vout=3.3V 1A 72dB@(120Hz) (LDO); Manufacturer 1: AMS; ComponentLink1Description: 供应商链接; ComponentLink1URL: http://www.szlcsc.com/product/details_6652.html; Package: SOT-223; Supplier: LC; SuppliersPartNumber: C6186; Manufacturer Part Number 1: AMS1117-3.3
Y1 = YSX321SL: Crystal or Oscillator; Manufacturer_Name: YXC; Datasheet Link: https://datasheet.lcsc.com/szlcsc/YSX321SL-30MHZ-10PF-8PPM_C70576.pdf; Height: 0.8mm; Manufacturer_Part_Number: YSX321SL; SuppliersPartNumber: C9002

## Sheet I2C_Keypad.SchDoc: STM32F446 CNC
size B; Author: AM; CompanyName: Expatria Technologies; DrawnBy: A.Marles; Engineer: AM; Organization: Expatria Technolgoies; DocumentNumber: 12; Revision: A3; SheetNumber: 12; SheetTotal: 14
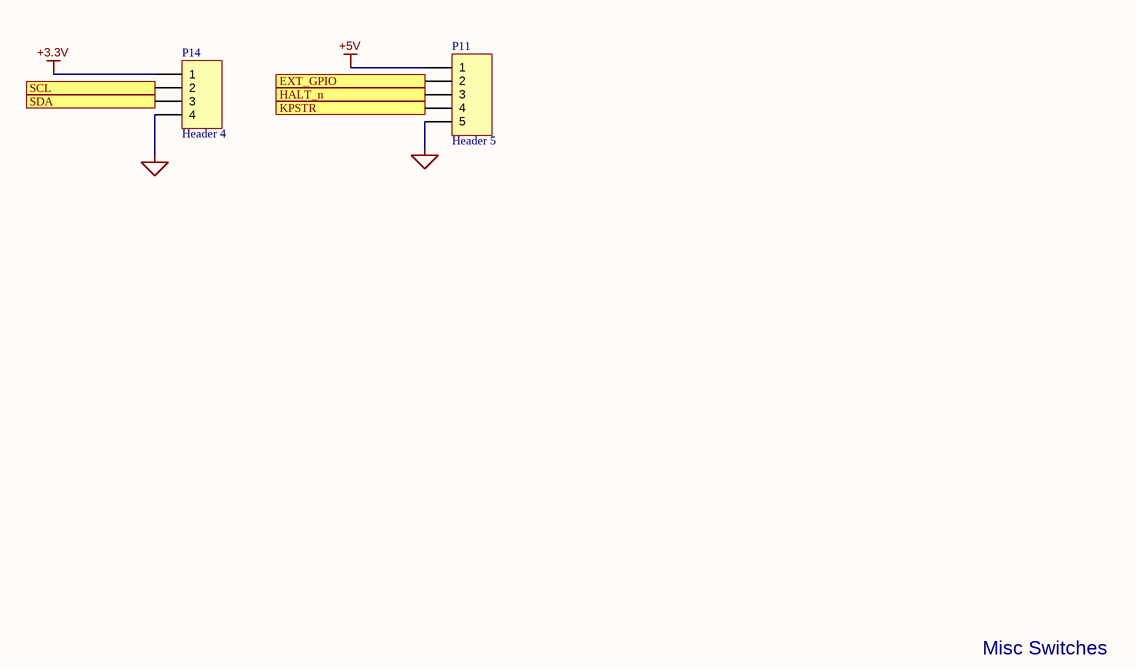
[diagram p4: I2C_Keypad.SchDoc]

### Parts
P11  Header 5  [HDR1X5]
P14  Header 4  [HDR1X4]

### Ports
EXT_GPIO (out), HALT_n (out), KPSTR (out), SCL (in), SDA (in)

### Nets
+3.3V: P14.1
+5V: P11.1
MCU_GND: P11.5 P14.4  [project net GND]
GPIO6: P11.2 ; port EXT_GPIO
HALT_KEYPAD: P11.3 ; port HALT_n
KPSTR: P11.4 ; port KPSTR
SCL/RXD: P14.2 ; port SCL
SDA/TXD: P14.3 ; port SDA

### Notes on the sheet
- Misc Switches
- SHEET
- Expatria Technologies
- 1136 Glade Court
- Port Coquitlam, BC V3B 1R5
- PROJECT
- SIZE
- ENGR
- MODIFIED
- DOCUMENT
- REV
- Copyright Expatria Technologies 2023. This document describes Open Hardware and is licensed under the CERN-OHL-S v2. No warranty is implied or expressed.
- EMAIL: INFO@EXPATRIA.CA
- B
- /

### Library data of the parts
P11 = Header 5: Header, 5-Pin; LatestRevisionDate: 17-Jul-2002; LatestRevisionNote: Re-released for DXP Platform.; Publisher: Altium Limited; SuppliersPartNumber: C124379
P14 = Header 4: Header, 4-Pin; Publisher: Altium Limited; SuppliersPartNumber: C124378

## Nets that join several sheets
+3.3V: PicoBOB_DLX (9 pins), RP2040_MCU (24 pins), I2C_Keypad (P14.1)
+5V: PicoBOB_DLX (11 pins), PWM (R56_PWM.2), EN (R56_EN.2), Xs (R56_Xs.2), Xd (R56_Xd.2), Ys (R56_Ys.2), Yd (R56_Yd.2), Zs (R56_Zs.2), Zd (R56_Zd.2), As (R56_As.2), Ad (R56_Ad.2), Bs (R56_Bs.2), Bd (R56_Bd.2), RP2040_MCU (5 pins), I2C_Keypad (P11.1)
GND: PicoBOB_DLX (64 pins), PWM (Q13_PWM.2), EN (Q13_EN.2), Xs (Q13_Xs.2), Xd (Q13_Xd.2), Ys (Q13_Ys.2), Yd (Q13_Yd.2), Zs (Q13_Zs.2), Zd (Q13_Zd.2), As (Q13_As.2), Ad (Q13_Ad.2), Bs (Q13_Bs.2), Bd (Q13_Bd.2), RP2040_MCU (35 pins), I2C_Keypad (P11.5 P14.4)
BOOT: PicoBOB_DLX (SW2.2), RP2040_MCU (R2.1)
DIR_A: Ad (R83_Ad.1), RP2040_MCU (U1.15)
DIR_A_5V: PicoBOB_DLX (J1.9), Ad (Q13_Ad.3 R56_Ad.1)
DIR_B: Bd (R83_Bd.1), RP2040_MCU (U1.16)
DIR_B_5V: PicoBOB_DLX (J1.17), Bd (Q13_Bd.3 R56_Bd.1)
DIR_X: Xd (R83_Xd.1), RP2040_MCU (U1.12)
DIR_X_5V: PicoBOB_DLX (J1.3), Xd (Q13_Xd.3 R56_Xd.1)
DIR_Y: Yd (R83_Yd.1), RP2040_MCU (U1.13)
DIR_Y_5V: PicoBOB_DLX (J1.5), Yd (Q13_Yd.3 R56_Yd.1)
DIR_Z: Zd (R83_Zd.1), RP2040_MCU (U1.14)
DIR_Z_5V: PicoBOB_DLX (J1.7), Zd (Q13_Zd.3 R56_Zd.1)
GPIO6: RP2040_MCU (U1.8), I2C_Keypad (P11.2)
GPIO_LED: PicoBOB_DLX (D2.A), RP2040_MCU (U1.9)
HALT: PicoBOB_DLX (U18.10), RP2040_MCU (U1.5)
HALT_KEYPAD: RP2040_MCU (U1.18), I2C_Keypad (P11.3)
KPSTR: RP2040_MCU (U1.39), I2C_Keypad (P11.4)
PICO_RUN: PicoBOB_DLX (SW1.2), RP2040_MCU (C43.2 U1.26)
PROBE: PicoBOB_DLX (U18.8), RP2040_MCU (U1.6)
SCL/RXD: RP2040_MCU (U1.41), I2C_Keypad (P14.2)
SDA/TXD: RP2040_MCU (U1.40), I2C_Keypad (P14.3)
SPI_CLK: PicoBOB_DLX (U2.33), RP2040_MCU (U1.29)
SPI_CSn: PicoBOB_DLX (U2.32), RP2040_MCU (U1.28)
SPI_PICO: PicoBOB_DLX (U2.35), RP2040_MCU (U1.30)
SPI_POCI: PicoBOB_DLX (U2.34), RP2040_MCU (U1.27)
SPINDLE_PWM: PWM (R83_PWM.1), RP2040_MCU (U1.17)
SPINDLE_PWM_5V: PicoBOB_DLX (J1.1), PWM (Q13_PWM.3 R56_PWM.1)
STEP_A: As (R83_As.1), RP2040_MCU (U1.37)
STEP_A_5V: PicoBOB_DLX (J1.8), As (Q13_As.3 R56_As.1)
STEP_B: Bs (R83_Bs.1), RP2040_MCU (U1.38)
STEP_B_5V: PicoBOB_DLX (J1.16), Bs (Q13_Bs.3 R56_Bs.1)
STEP_X: Xs (R83_Xs.1), RP2040_MCU (U1.34)
STEP_X_5V: PicoBOB_DLX (J1.2), Xs (Q13_Xs.3 R56_Xs.1)
STEP_Y: Ys (R83_Ys.1), RP2040_MCU (U1.35)
STEP_Y_5V: PicoBOB_DLX (J1.4), Ys (Q13_Ys.3 R56_Ys.1)
STEP_Z: Zs (R83_Zs.1), RP2040_MCU (U1.36)
STEP_Z_5V: PicoBOB_DLX (J1.6), Zs (Q13_Zs.3 R56_Zs.1)
STP_EN_XYZAB: EN (R83_EN.1), RP2040_MCU (U1.11)
STP_EN_XYZAB_5V: PicoBOB_DLX (J1.14), EN (Q13_EN.3 R56_EN.1)
W5500_INTn: PicoBOB_DLX (R30.1 U2.36), RP2040_MCU (U1.31)
W5500_RSTn: PicoBOB_DLX (C42.2 R14.1 U2.37), RP2040_MCU (U1.32)
X_LIM: PicoBOB_DLX (U18.4), RP2040_MCU (U1.4)
Y_LIM: PicoBOB_DLX (U18.2), RP2040_MCU (U1.3)
Z_LIM: PicoBOB_DLX (U18.6), RP2040_MCU (U1.7)

## Assembly variants
SMT_ONLY: not fitted J1_LS_A J1_LS_X J1_LS_Y J1_LS_Z J2_LS_A J2_LS_X J2_LS_Y J2_LS_Z J3_PH_CY J3_PH_DR J3_PH_FD J3_PH_HLT J3_PH_PR J5 P1 P2 P3 P4 P5 P6 P7 P8 P9 P10 P12_STP_A P12_STP_X P12_STP_Y P12_STP_Z P13 R7_LS_X
FULL_PLACE: not fitted P1